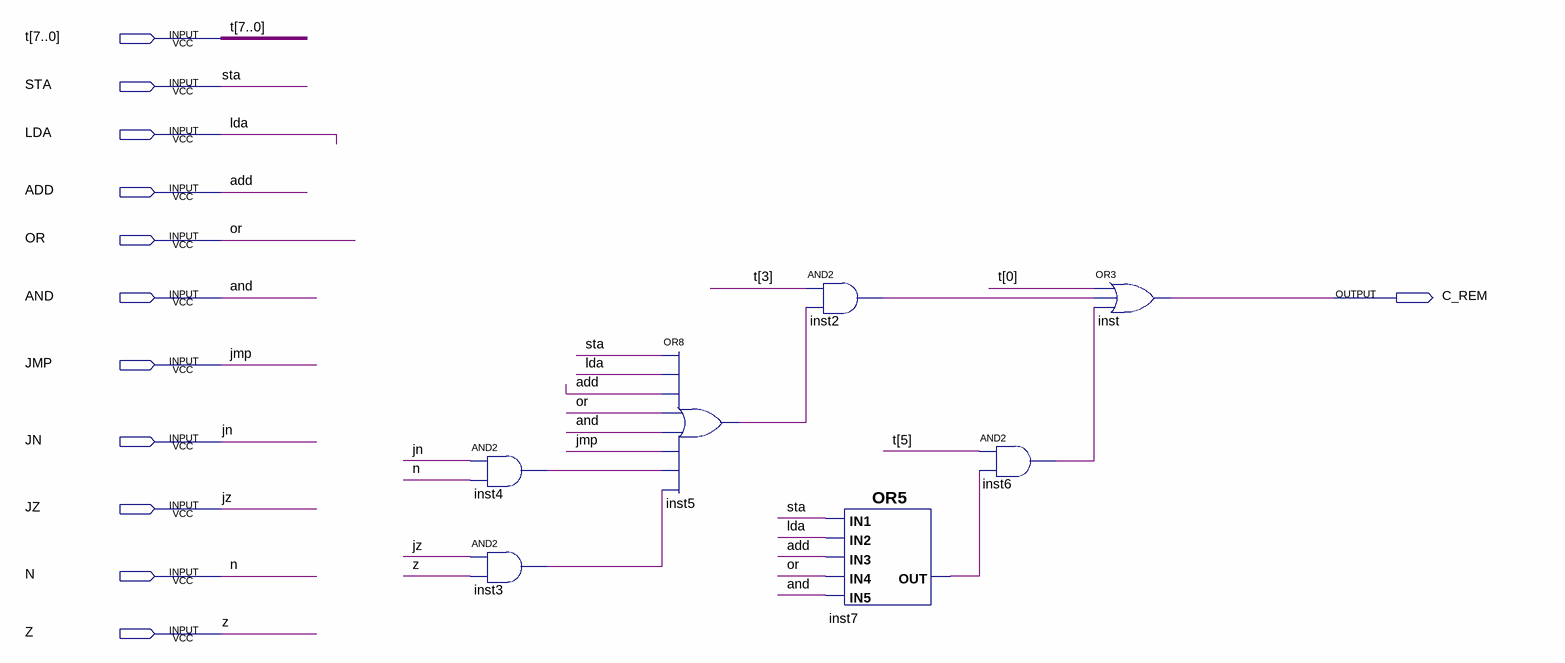
[diagram p0: schematic sheet]
// Quartus schematic CARGA_REM.bdf as structural Verilog: 7 symbols, 12 pins
module CARGA_REM (
  input  [7:0] t,
  input  STA,
  input  LDA,
  input  ADD,
  input  OR,
  input  AND,
  input  JMP,
  input  JN,
  input  JZ,
  input  N,
  input  Z,
  output C_REM
);

  wire inst2_out, inst3_out, inst4_out, inst5_out, inst6_out, inst7_out;

  and inst4 (inst4_out, JN, N);
  and inst3 (inst3_out, JZ, Z);
  or inst5 (inst5_out, STA, LDA, ADD, OR, AND, JMP, inst4_out, inst3_out);
  and inst2 (inst2_out, t[3], inst5_out);
  or inst7 (inst7_out, STA, LDA, ADD, OR, AND);
  and inst6 (inst6_out, t[5], inst7_out);
  or inst (C_REM, t[0], inst2_out, inst6_out);
endmodule
